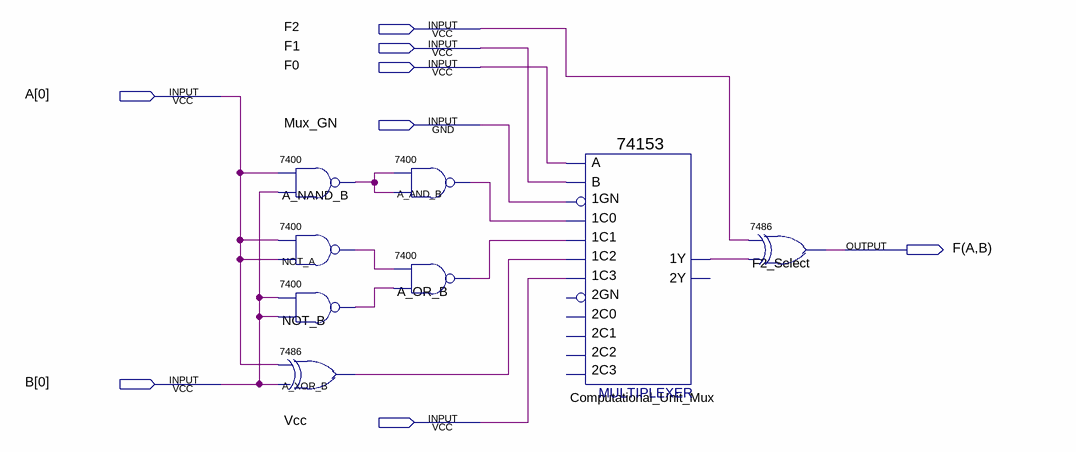
[diagram p0: schematic sheet]
// Quartus schematic 4-bit_logic_processor_schematic_computational_unit.bdf as structural Verilog: 8 symbols, 8 pins
module \4-bit_logic_processor_schematic_computational_unit  (
  input  F2,
  input  F1,
  input  F0,
  input  [0:0] A,
  input  Mux_GN,
  input  [0:0] B,
  input  Vcc,
  output \F(A ,
  output \B) 
);

  wire A_AND_B_1, A_NAND_B_1, A_OR_B_1, A_XOR_B_1, Computational_Unit_Mux_1y, F2_Select_1, NOT_A_1, NOT_B_1;

  \7400  A_NAND_B (.\3 (B[0]), .\2 (A[0]), .\1 (A_NAND_B_1));
  \7400  NOT_A (.\3 (A[0]), .\2 (A[0]), .\1 (NOT_A_1));
  \7400  NOT_B (.\3 (B[0]), .\2 (B[0]), .\1 (NOT_B_1));
  \7486  A_XOR_B (.\2 (A[0]), .\3 (B[0]), .\1 (A_XOR_B_1));
  \7400  A_AND_B (.\3 (A_NAND_B_1), .\2 (A_NAND_B_1), .\1 (A_AND_B_1));
  \7400  A_OR_B (.\3 (NOT_B_1), .\2 (NOT_A_1), .\1 (A_OR_B_1));
  \74153  Computational_Unit_Mux (
    .\1C1 (A_OR_B_1), .\1GN (Mux_GN), .\1C0 (A_AND_B_1), .\1C2 (A_XOR_B_1), .\1C3 (Vcc), .B(F1), .A(F0),
    .\1Y (Computational_Unit_Mux_1y));  // open: 2C0, 2GN, 2C2, 2C1, 2C3, 2Y
  \7486  F2_Select (.\2 (F2), .\3 (Computational_Unit_Mux_1y), .\1 (F2_Select_1));
endmodule
